# EAGLE design GIANTpanda (EAGLE 7.6.0)
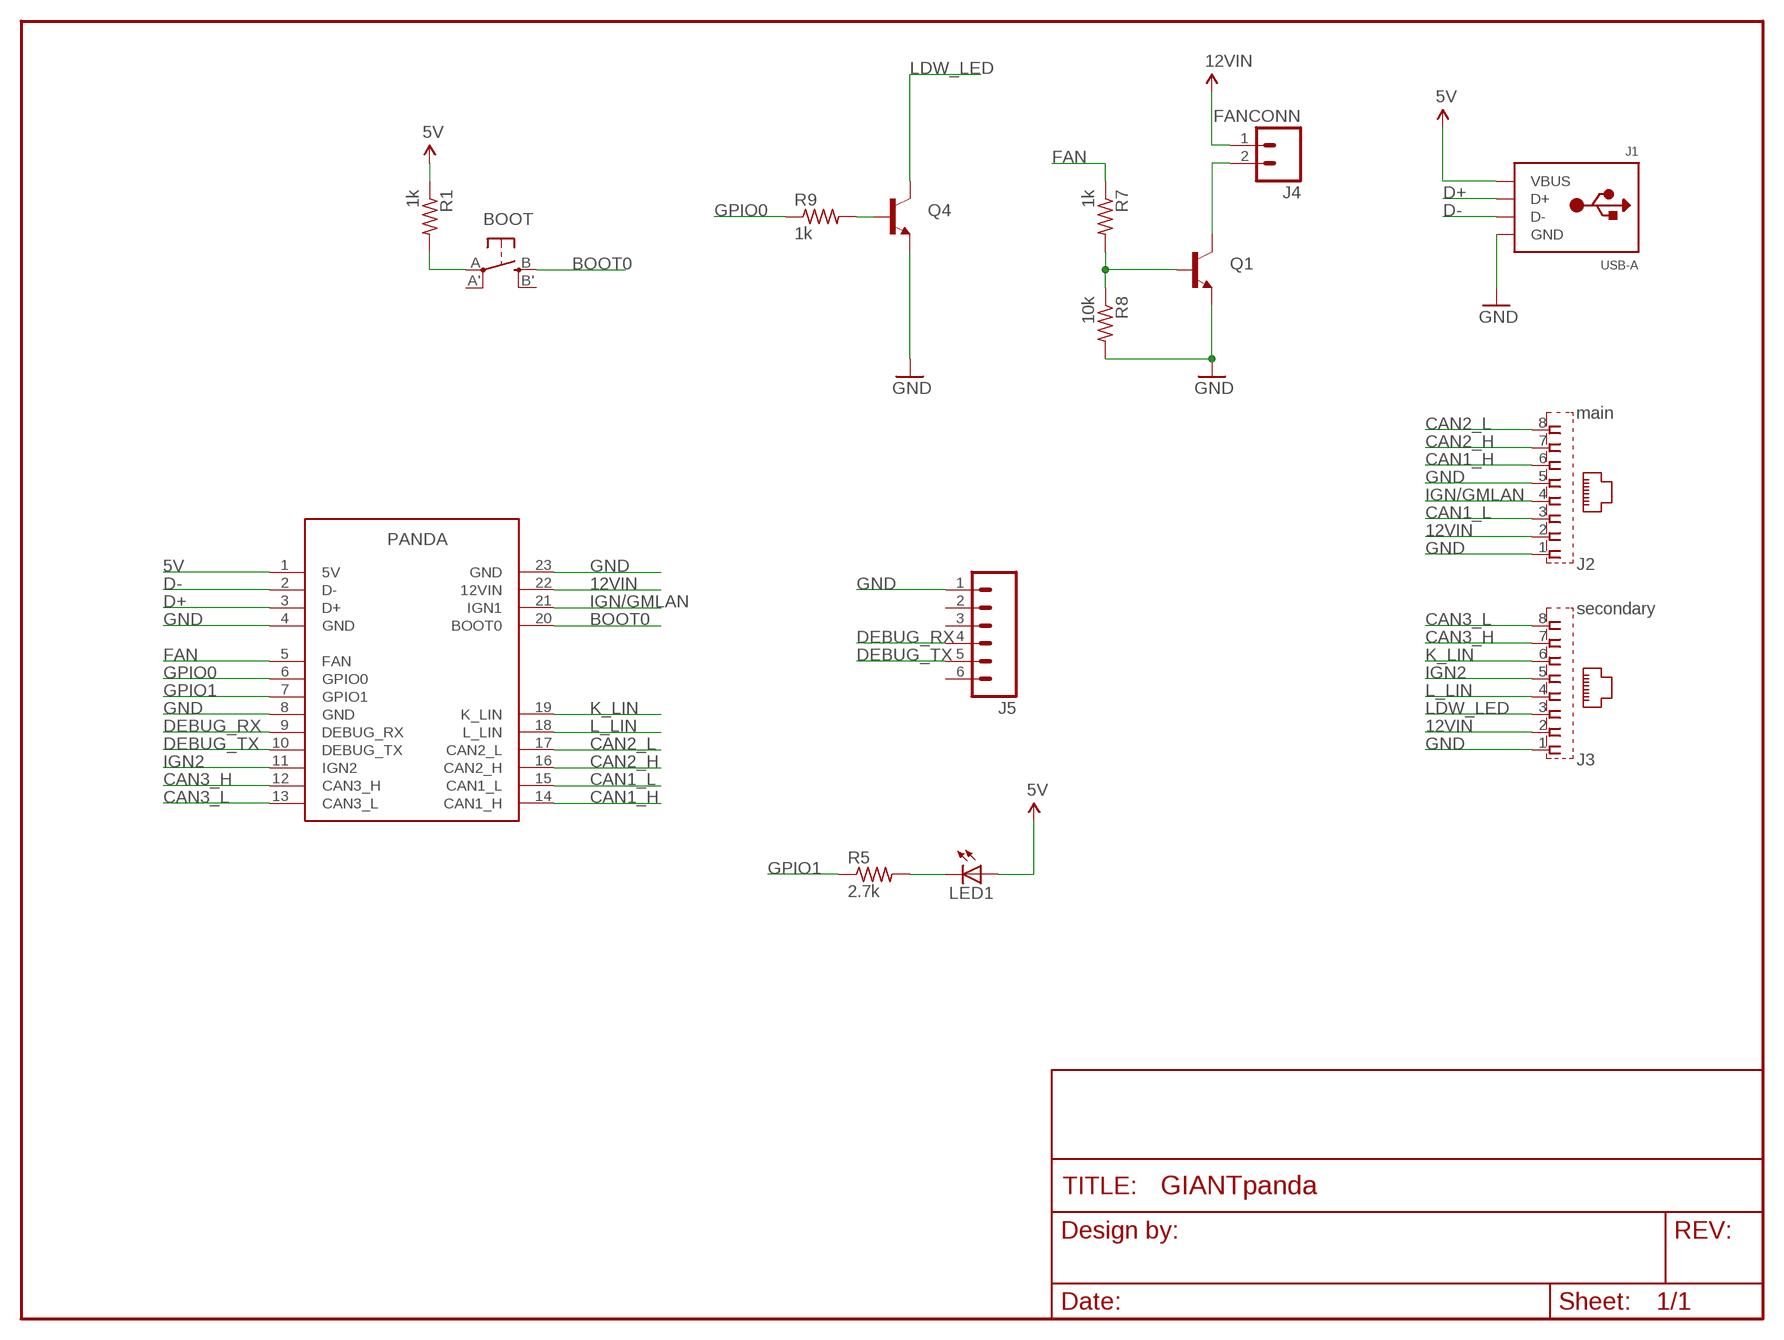
[diagram p0: schematic, sheet 1]

## Parts
BOOT  SPST_TACT-EVQQ2  [EVQ-Q2]
FRAME1  FRAME-LETTERNO_PACKAGE  [DUMMY]
J1  USB-A  [MOLEX_480371000]
J2  main  VERT_RJ45  [GLX-S-88M]
J3  secondary  VERT_RJ45  [GLX-S-88M]
J4  FANCONN  [1.25CONN]
J5  M06NO_SILK_YES_STOP  [1X06_NO_SILK_YES_STOP]
LED1  LEDCHIPLED_0805  [CHIPLED_0805]
Q1  MMBT2222A  TRANSISTOR_NPNMMBT2222A  [SOT23-3]
Q4  MMBT2222A  TRANSISTOR_NPNMMBT2222A  [SOT23-3]
R1  1k  R0603  [0603-R]
R5  2.7k  R0603  [0603-R]
R7  1k  R0603  [0603-R]
R8  10k  R0603  [0603-R]
R9  1k  R0603  [0603-R]
U$1  PANDA  [PANDA-FOOT]

## Nets
5V: J1.1(VBUS) LED1.A R1.1 U$1.1(5V)
12VIN: J2.2 J3.2 J4.1 U$1.22(12VIN)
BOOT0: BOOT.B(S) U$1.20(BOOT0)
CAN1_H: J2.6 U$1.14(CAN1_H)
CAN1_L: J2.3 U$1.15(CAN1_L)
CAN2_H: J2.7 U$1.16(CAN2_H)
CAN2_L: J2.8 U$1.17(CAN2_L)
CAN3_H: J3.7 U$1.12(CAN3_H)
CAN3_L: J3.8 U$1.13(CAN3_L)
D+: J1.3(D+) U$1.3(D+)
D-: J1.2(D-) U$1.2(D-)
DEBUG_RX: J5.4 U$1.9(DEBUG_RX)
DEBUG_TX: J5.5 U$1.10(DEBUG_TX)
FAN: R7.1 U$1.5(FAN)
GND: J1.4(GND) J2.1 J2.5 J3.1 J5.1 Q1.2(E) Q4.2(E) R8.2 U$1.4(GND) U$1.8(GND) U$1.23(GND)
GPIO0: R9.1 U$1.6(GPIO0)
GPIO1: R5.1 U$1.7(GPIO1)
IGN2: J3.5 U$1.11(IGN2)
IGN/GMLAN: J2.4 U$1.21(IGN1)
K_LIN: J3.6 U$1.19(K_LIN)
L_LIN: J3.4 U$1.18(L_LIN)
LDW_LED: J3.3 Q4.3(C)
N$1: BOOT.A(P) R1.2
N$3: LED1.C R5.2
N$6: J4.2 Q1.3(C)
N$7: Q1.1(B) R7.2 R8.1
N$21: Q4.1(B) R9.2
Unconnected: BOOT.A'(P1) BOOT.B'(S1) J5.2 J5.3 J5.6

## Library data of the parts
BOOT = adafruit:SPST_TACT: SMT 6mm switch, EVQQ2 series http://www.ladyada.net/library/eagle
FRAME1 = SparkFun-Aesthetics:FRAME-LETTER: Schematic Frame Standard 8.5x11 US Letter frame; DESIGNER: Nobody; VERSION: v01
J1 = adafruit:USB-A: USB type A 'plug' Used for things that can directly connect to a USB port, say USB key
J2 J3 = comma.ai:VERT_RJ45: Mod. Jack, Right Angle, 8 posiotion, 8 contatcs RJ45 Source: GLX-S-88M.pdf; OC_FARNELL: unknown; OC_NEWARK: unknown
J4 = comma.ai:FANCONN
J5 = SparkFun-Connectors:M06: Header 6 Standard 6-pin 0.1" header. Use with straight break away headers (SKU : PRT-00116), right angle break away headers (PRT-00553), swiss pins (PRT-00743), machine pins (PRT-00117), and female headers (PRT-00115). Molex polarized connector foot print use with SKU : PRT-08094 with associated crimp pins and housings. NOTES ON THE VARIANTS LOCK and LOCK_LONGPADS... This footprint was designed to help hold the alignment of a through-hole component (i.e. 6-pin header) while soldering it into place. You may notice that each hole has been shifted either up or down by 0.005 of an inch from it's more standard position (which is a perfectly straight line). This slight alteration caused the pins (the squares in the middle) to touch the edges of the holes. Because they are alternating, it causes a "brace" to hold the component in place. 0.005 has proven to be the perfect amount of "off-center" position when using our standard breakaway headers. Although looks a little odd when you look at the bare footprint, once you have a header in there, the alteration is very hard to notice. Also,if you push a header all the way into place, it is covered up entirely on the bottom side. This idea of altering the position of holes to aid alignment will be further integrated into the Sparkfun Library for other footprints. It can help hold any component with 3 or more connection pins.
LED1 = adafruit:LED: LED OSRAM: - CHIPLED LG R971, LG N971, LY N971, LG Q971, LY Q971, LO R971, LY R971 LH N974, LH R974 LS Q976, LO Q976, LY Q976 LO Q996 - Hyper CHIPLED LW Q18S LB Q993, LB Q99A, LB R99A - SideLED LS A670, LO A670, LY A670, LG A670, LP A670 LB A673, LV A673, LT A673, LW A673 LH A674 LY A675 LS A676, LA A676, LO A676, LY A676, LW A676 LS A679, LY A679, LG A679 - Hyper Micro SIDELED® LS Y876, LA Y876, LO Y876, LY Y876 LT Y87S - SmartLED LW L88C, LW L88S LB L89C, LB L89S, LG L890 LS L89K, LO L89K, LY L89K LS L896, LA L896, LO L896, LY L896 - TOPLED LS T670, LO T670, LY T670, LG T670, LP T670 LSG T670, LSP T670, LSY T670, LOP T670, LYG T670 LG T671, LOG T671, LSG T671 LB T673, LV T673, LT T673, LW T673 LH T674 LS T676, LA T676, LO T676, LY T676, LB T676, LH T676, LSB T676, LW T676 LB T67C, LV T67C, LT T67C, LS T67K, LO T67K, LY T67K, LW E67C LS E67B, LA E67B, LO E67B, LY E67B, LB E67C, LV E67C, LT E67C LW T67C LS T679, LY T679, LG T679 LS T770, LO T770, LY T770, LG T770, LP T770 LB T773, LV T773, LT T773, LW T773 LH T774 LS E675, LA E675, LY E675, LS T675 LS T776, LA T776, LO T776, LY T776, LB T776 LHGB T686 LT T68C, LB T68C - Hyper Mini TOPLED® LB M676 - Mini TOPLED Santana® LG M470 LS M47K, LO M47K, LY M47K Source: http://www.osram.convergy.de/
Q1 Q4 = SparkFun-DiscreteSemi:TRANSISTOR_NPN: Generic NPN BJT MMBT2222A - TRANS-08049 (SOT-23, 1A 40V) MPSA42 - TRANS-09116 (SOT-23, 500mA 300V) MMBT5088LT1G - TRANS-11160 (SOT-23, 50 mA 30V) BC547 - COM-08928 <http://www.sparkfun.com/products/8928> (TO-92 45V 100mA) (1.Collector 2.Base 3.Emitter) 2N3904 - COM-00521 <http://www.sparkfun.com/products/521> (TO-92 40V 200mA) (1.Emitter 2.Base 3.Collector) P2N2222A - COM-12852 <http://www.sparkfun.com/products/12852> (TO-92 40V 600mA) (1.Collector 2.Base 3.Emitter); PROD_ID: TRANS-08049
R1 R5 R7-R9 = comma.ai:R
U$1 = comma.ai:PANDA

## Board
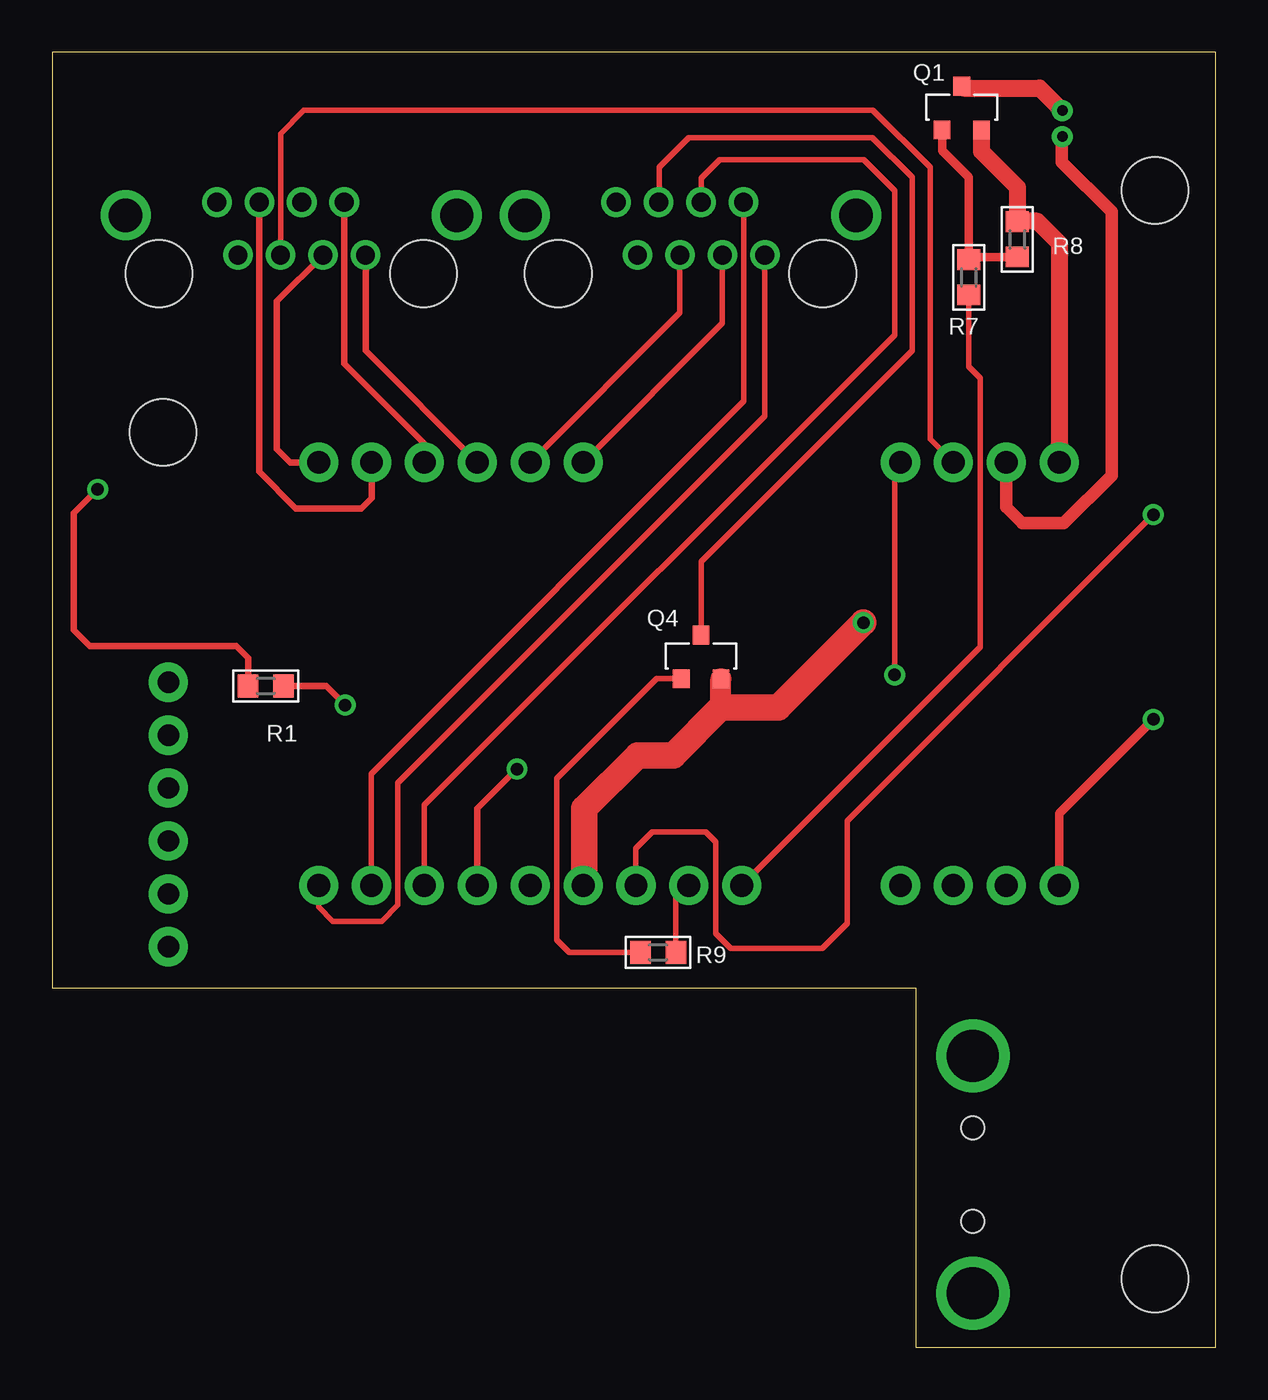
[diagram p1: board, top side]
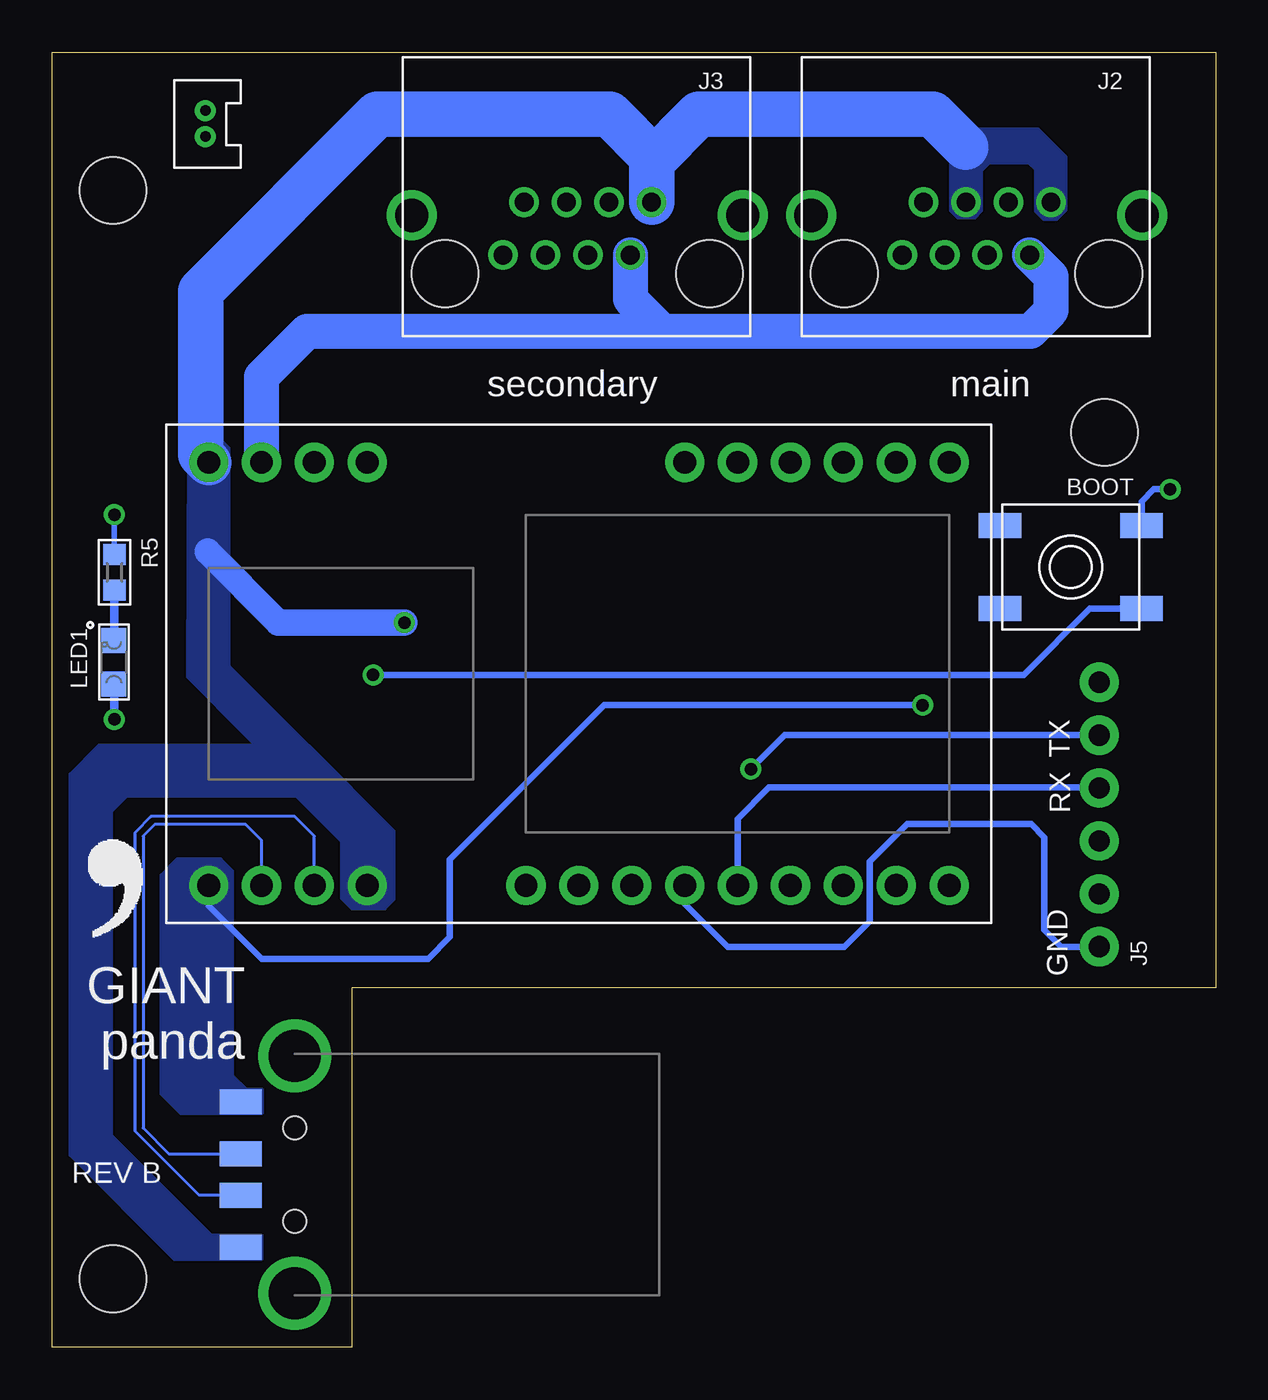
[diagram p2: board, bottom side, seen from below]

Size 55.88 x 62.23 mm. Coordinates in mm from the lower left corner, seen from the top.
Outline: 55.88,62.23 0,62.23 0,17.27 41.48,17.27 41.48,0 55.88,0 55.88,62.23
Copper layers (1*16): Top 0.035mm / dielectric 1.5mm / Bottom 0.035mm
Design rules "default *": minimum track width 6mil, minimum drill 24mil, track to track 6mil, track to pad 6mil, pad to pad 6mil, via to via 6mil, smd to smd 6mil, copper to edge 10mil, drill to drill 8mil, minimum pad ring 10mil, minimum via ring 8mil, stop-mask expansion 4mil, vias tented up to drill 0mil, thermal gap 10mil
Holes 3.2 mm at 5.33,43.97 52.96,55.58 52.96,3.3

### Footprints (pad centres in the part's own frame; a part is rotated, then mirrored left to right if it is on the bottom)
EVQ-Q2 = smd 2.032 x 1.2: A -3.4,-2; A' 3.4,-2; B -3.4,2; B' 3.4,2
MOLEX_480371000 = smd 1.2 x 2: 1 3.5,2.6; 2 1,2.6; 3 -1,2.6; 4 -3.5,2.6 | drill 2.5: M1 -5.7,0; M2 5.7,0 | hole 1.1: -2.25,0; 2.25,0
GLX-S-88M = drill 0.9 pad 1.422: 1 -4.66,-3.43; 2 -3.64,-0.89; 3 -2.62,-3.43; 4 -1.6,-0.89; 5 -0.58,-3.43; 6 0.44,-0.89; 7 1.46,-3.43; 8 2.48,-0.89 | drill 1.6 pad 2.184: S1 -9.04,-2.8; S2 6.86,-2.8 | hole 3.2: -7.44,0; 5.26,0
1.25CONN = drill 0.5: 1 0,0; 2 1.25,0
1X06_NO_SILK_YES_STOP = drill 1.016 pad 1.88: 1 0,0; 2 2.54,0; 3 5.08,0; 4 7.62,0; 5 10.16,0; 6 12.7,0
CHIPLED_0805 = smd 1.2 x 1.2: A 0,-1.05; C 0,1.05
SOT23-3 = smd 0.8 x 0.9: 1 -0.95,-1; 2 0.95,-1; 3 0,1.1
0603-R = smd 1 x 1.1: 1 -0.85,0; 2 0.85,0
PANDA-FOOT = drill 1.1 pad 1.88: 1 -17.78,-10.16; 2 -15.24,-10.16; 3 -12.7,-10.16; 4 -10.16,-10.16; 5 -2.54,-10.16; 6 0,-10.16; 7 2.54,-10.16; 8 5.08,-10.16; 9 7.62,-10.16; 10 10.16,-10.16; 11 12.7,-10.16; 12 15.24,-10.16; 13 17.78,-10.16; 14 17.78,10.16; 15 15.24,10.16; 16 12.7,10.16; 17 10.16,10.16; 18 7.62,10.16; 19 5.08,10.16; 20 -10.16,10.16; 21 -12.7,10.16; 22 -15.24,10.16; 23 -17.78,10.16

### Placement (x,y rotation side)
BOOT  6.96,37.49 180 bottom
FRAME1  -11.43,-3.81 0 top  (outside the outline)
J1  44.22,8.31 90 bottom
J2  12.57,51.59 180 bottom
J3  31.75,51.59 180 bottom
J4  48.51,58.17 90 bottom
J5  5.59,19.25 90 top
LED1  52.91,32.92 0 bottom
Q1  43.69,59.49 0 top
Q4  31.17,33.12 0 top
R1  10.26,31.78 180 top
R5  52.88,37.24 270 bottom
R7  44.02,51.41 90 top
R8  46.36,53.24 90 top
R9  29.11,18.97 180 top
U$1  30.58,32.36 0 bottom
U$2  [LOGO]  54.81,19.41 0 bottom

### Tracks (layer width: path | path; a pad name or v marks a point on that pad's centre or on a via)
5V  (via drill 0.6)
  Top 0.305: v14.07,30.86 13.16,31.78 R1.1
  Top 0.406: U$1.1 48.36,25.65 v52.88,30.18
  Bottom 0.305: U$1.1 48.36,21.21 45.82,18.67 37.82,18.67 36.78,19.71 36.78,23.44 29.36,30.86 v14.07,30.86
  Bottom 0.406: v52.88,30.18 52.88,31.84 LED1.A
  pour Bottom (no thermals): 45.8,12.42 45.8,11.23 49.71,11.23 50.65,12.17 50.65,22.71 49.86,23.5 47.8,23.5 47.22,22.91 47.22,13.08 46.58,12.45 46.56,12.42
12VIN
  Top 0.61: U$1.22 45.82,40.36 46.58,39.6 48.59,39.6 50.88,41.88 50.88,54.56 48.49,56.95 48.49,58.14 J4.1
  Bottom 1.676: U$1.22 45.82,46.63 43.64,48.82 26.57,48.82 | 26.57,48.82 8.89,48.82 7.9,49.81 7.9,51.44 J2.2 | J3.2 28.11,50.36 26.57,48.82
BOOT0  (via drill 0.6)
  Top 0.254: v40.46,32.31 40.46,42.24 U$1.20
  Bottom 0.305: 40.31,32.16 v40.46,32.31 9.22,32.31 6.04,35.49 BOOT.B
CAN1_H
  Top 0.305: U$1.14 11.43,42.52 10.79,43.16 10.79,50.26 J2.6
CAN1_L
  Top 0.305: J2.3 9.95,42.07 11.71,40.31 14.86,40.31 15.34,40.79 U$1.15
CAN2_H
  Top 0.305: U$1.16 17.88,43.41 14.03,47.26 J2.7
CAN2_L
  Top 0.305: J2.8 15.05,47.89 U$1.17
CAN3_H
  Top 0.254: J3.7 33.21,45.45 15.32,27.56 15.32,22.23 U$1.12
CAN3_L
  Top 0.254: 12.78,22.23 U$1.13 12.8,21.16 13.49,20.47 15.82,20.47 16.61,21.26 16.61,27.13 34.23,44.75 J3.8
D+
  Bottom 0.152: U$1.3 43.28,24.56 44.22,25.5 51.13,25.5 51.89,24.74 51.89,10.39 48.82,7.31 46.83,7.31 J1.3
D-
  Bottom 0.152: U$1.2 45.82,24.36 46.58,25.12 50.95,25.12 51.51,24.56 51.51,10.54 50.27,9.3 46.83,9.3 J1.2
DEBUG_RX
  Bottom 0.305: U$1.9 22.96,25.4 21.46,26.9 5.61,26.9 J5.4
DEBUG_TX  (via drill 0.6)
  Top 0.305: v22.33,27.79 20.42,25.88 U$1.10
  Bottom 0.305: J5.5 20.7,29.41 v22.33,27.79
FAN
  Top 0.254: U$1.5 44.58,33.66 44.58,46.56 44.02,47.12 R7.1
GND  (via drill 0.6)
  Top 0.406: Q1.2 44.63,58.48 | R8.2 46.65,54.05
  Top 0.813: 44.63,58.48 44.63,57.45 46.36,55.73 R8.2 46.37,54.1 47.32,54.1 48.36,53.06 U$1.23 | 46.65,54.05 46.7,54.1
  Top 1.016: U$1.8 25.55,22.25 | 32.12,30.74 Q4.2
  Top 1.27: 25.55,22.25 25.55,25.88 28.12,28.45 29.82,28.45 32.12,30.74 34.88,30.74 v38.96,34.82
  Bottom 0.305: U$1.8 25.5,21.31 23.44,19.25 17.83,19.25 16.61,20.47 16.61,23.34 14.81,25.15 8.86,25.15 8.23,24.51 8.23,20.07 7.42,19.25 J5.1
  Bottom 1.27: v38.96,34.82 45.01,34.82 48.41,38.23
  Bottom 2.184: U$1.23 48.74,42.9 48.74,50.75 40.26,59.23 29.11,59.23 27.09,57.21 J3.1 27.09,56.96 24.82,59.23 13.59,59.23 12.01,57.66
  pour Bottom (no thermals): 45.82,5.41 45.82,4.22 50.01,4.22 55.02,9.22 55.02,27.56 53.64,28.93 43.56,28.93 39.47,24.84 39.47,21.49 39.9,21.06 41.48,21.06 41.96,21.54 41.96,24.28 44.15,26.47 52.3,26.47 53.04,25.73 53.04,10.21 48.26,5.44 48.23,5.41
  pour Bottom (no thermals): 47.4,43.23 47.4,32.77 43.05,28.42 43.05,27.23 43.43,26.85 43.71,26.49 49.35,32.18 49.33,43.33 48.97,43.69 47.85,43.69
  pour Bottom (no thermals): 7.19,54.64 7.19,57.2 8.51,58.52 11.76,58.52 12.75,57.53 12.75,54.61 12.42,54.28 11.56,54.28 11.23,54.61 11.23,56.54 10.85,56.92 8.99,56.92 8.66,56.59 8.66,54.58 8.28,54.2 7.62,54.2
GPIO0
  Top 0.254: U$1.6 29.96,21.58 R9.1
GPIO1  (via drill 0.6)
  Top 0.254: U$1.7 28.04,23.98 28.83,24.77 31.39,24.77 31.88,24.28 31.88,19.89 32.59,19.18 36.98,19.18 38.18,20.37 38.18,25.3 v52.88,40
  Bottom 0.254: v52.88,40 R5.1
IGN2
  Top 0.254: U$1.11 17.88,26.06 40.46,48.64 40.46,55.57 38.99,57.05 32.05,57.05 31.17,56.16 J3.5
IGN/GMLAN
  Top 0.254: J2.4 10.97,58.32 12.09,59.44 39.42,59.44 42.16,56.69 42.16,43.64 U$1.21
K_LIN
  Top 0.254: U$1.19 32.19,49.21 J3.6
L_LIN
  Top 0.254: J3.4 30.15,49.71 U$1.18
LDW_LED
  Top 0.254: Q4.3 31.17,37.74 41.3,47.88 41.3,56.21 39.39,58.11 30.58,58.11 29.16,56.69 29.16,55.05 J3.3
N$1  (via drill 0.6)
  Top 0.305: v2.18,41.22 1.04,40.08 1.04,34.47 1.8,33.71 8.84,33.71 9.42,33.12 9.42,31.79 R1.2
  Bottom 0.305: v2.18,41.22 2.97,41.22 3.56,40.64 BOOT.A
N$3
  Bottom 0.254: 52.88,33.99 LED1.C
  Bottom 0.406: R5.2 52.88,33.99
N$6
  Top 0.406: 48.39,59.54 J4.2 | Q1.3 43.77,60.5
  Top 0.813: 43.77,60.5 47.42,60.5 J4.2
N$7
  Top 0.406: Q1.1 42.74,57.49 44.02,56.21 R7.2 44.15,52.39 R8.1
N$21
  Top 0.254: R9.2 24.84,18.97 24.23,19.58 24.23,27.33 29.03,32.13 30.21,32.13 Q4.1

### Text on the board
bNames: main | secondary | TX | RX | GND | GIANT / panda | REV B